# Altium schematic sheet microdevel_power.schdoc
size A4
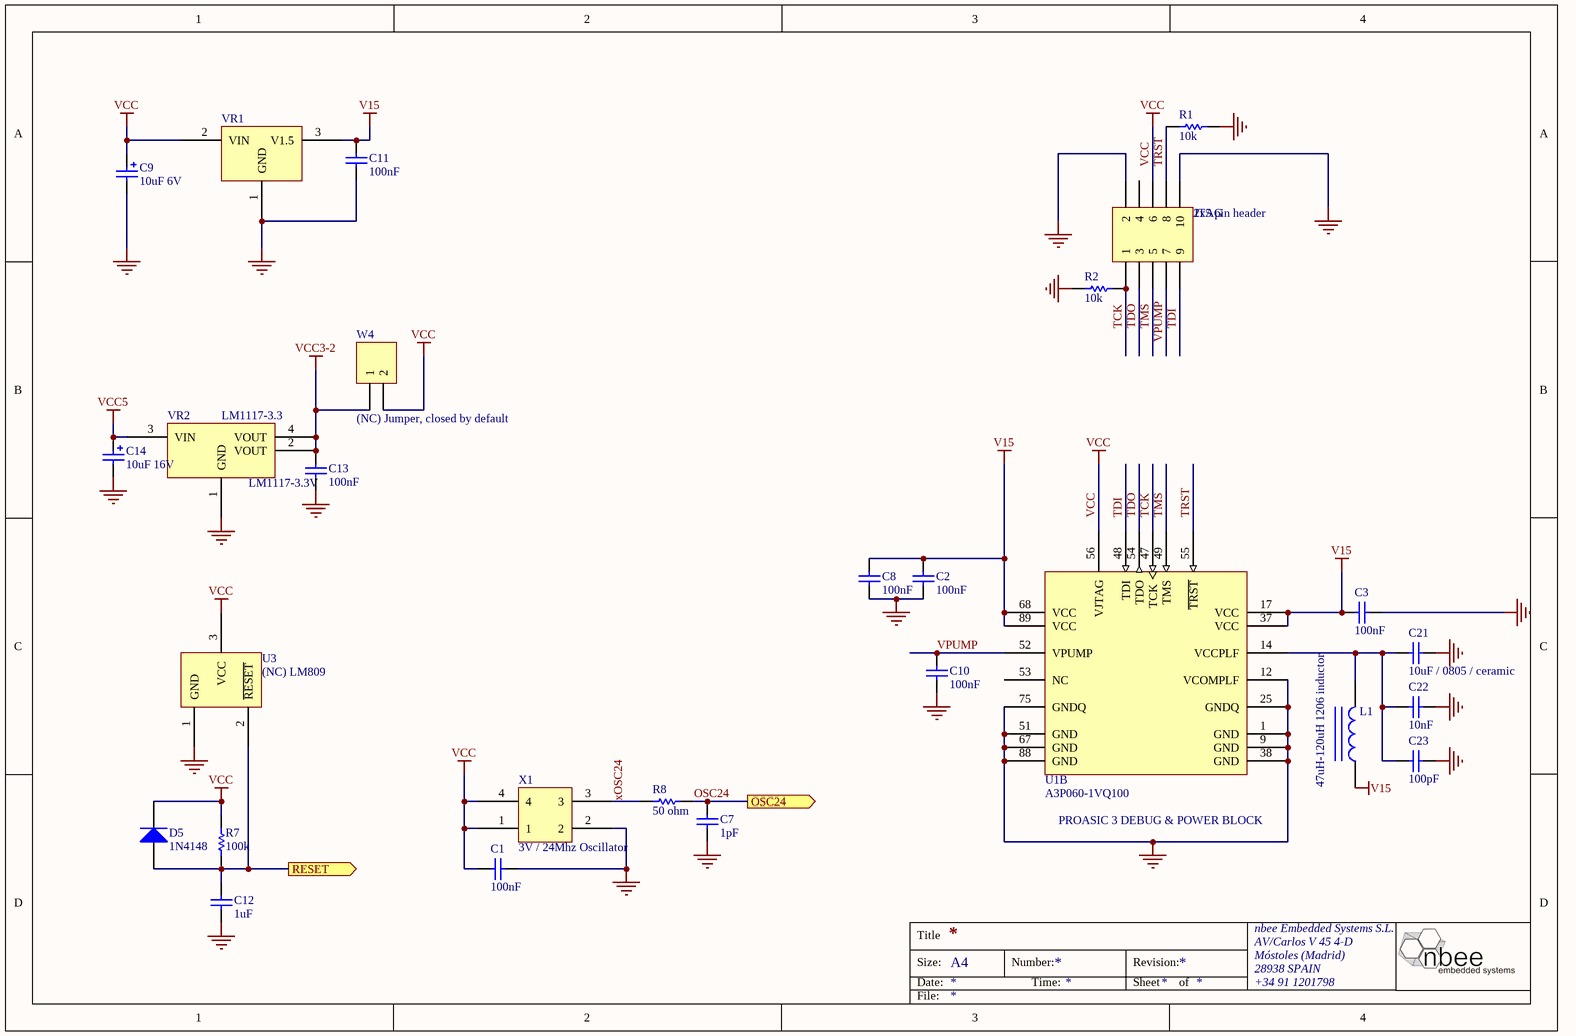
[diagram p0: microdevel_power.schdoc]

## Parts
C1  100nF  [0603]
C2  100nF  [0603]
C3  100nF  [0603]
C7  1pF  [0603]
C8  100nF  [0603]
C9  10uF 6V  [CC-6030]
C10  100nF  [0603]
C11  100nF  [0603]
C12  1uF  [0603]
C13  100nF  [0603]
C14  10uF 16V  [CC-6030]
C21  10uF / 0805 / ceramic  [0805]
C22  10nF  [0603]
C23  100pF  [0603]
D5  1N4148  [DIODE_1206]
JTAG  2x5 pin header  [HDR2X5]
L1  47uH-120uH 1206 inductor  [1206]
R1  10k  [0603]
R2  10k  [0603]
R7  100k  [0603]
R8  50 ohm  [0603]
U1  A3P060-1VQ100  [A3P060]  (part B of 2)
U3  (NC) LM809  [SOT23-2]
VR1  LDO 1.5V  [G4TOB]  (value not drawn)
VR2  LM1117-3.3V  value LM1117-3.3  [DSO-G3]
W4  (NC) Jumper, closed by default  [JUMPER]
X1  3V / 24Mhz Oscillator  [OSC 3x5mm]

## Ports
OSC24 (out), RESET (out)

## Nets
GND: C1.2 C2.1 C3.2 C7.1 C8.1 C9.2 C10.1 C11.1 C12.1 C13.1 C14.2 C21.2 C22.2 C23.2 JTAG.2 JTAG.10 R1.1 R2.1 U1.1(GND) U1.9(GND) U1.12(VCOMPLF) U1.25(GNDQ) U1.38(GND) U1.51(GND) U1.67(GND) U1.75(GNDQ) U1.88(GND) U3.1(GND) VR1.1(GND) VR2.1(GND) X1.2
V15: C2.2 C3.1 C8.2 C11.2 L1.1 U1.17(VCC) U1.37(VCC) U1.68(VCC) U1.89(VCC) VR1.3(V1.5)
VCC: C1.1 C9.1 D5.2(K) JTAG.6 R7.2 U1.56(VJTAG) U3.3(VCC) VR1.2(VIN) W4.2 X1.1 X1.4
VCC3-2: C13.2 VR2.2(VOUT) VR2.4(VOUT) W4.1
VCC5: C14.1 VR2.3(VIN)
OSC24: C7.2 R8.1 ; port OSC24
RESET: C12.2 D5.1(A) R7.1 U3.2(~{RESET}) ; port RESET
TCK: JTAG.1 R2.2 U1.47(TCK)
TDI: JTAG.9 U1.48(TDI)
TDO: JTAG.3 U1.54(TDO)
TMS: JTAG.5 U1.49(TMS)
TRST: JTAG.8 R1.2 U1.55(~{TRST})
VPUMP: C10.2 JTAG.7 U1.52(VPUMP)
xOSC24: R8.2 X1.3
NetC21_1: C21.1 C22.1 C23.1 L1.2 U1.14(VCCPLF)

Not connected (* = marked no-connect by the designer): JTAG 4; U1 53(NC)

## Notes on the sheet
- PROASIC 3 DEBUG & POWER BLOCK
- Title
- Size:
- Date:
- A4
- Number:
- Time:
- Revision:
- Sheet
- of
- nbee Embedded Systems S.L.
- AV/Carlos V 45 4-D
- Móstoles (Madrid)
- 28938 SPAIN
- +34 91 1201798
- File:

## Library data of the parts
C1-C3 C7 C8 C10-C13 C22 C23 = Cap Semi: Capacitor (Semiconductor SIM Model); Published: 8-Jun-2000; LatestRevisionDate: 17-Jul-2002; LatestRevisionNote: Re-released for DXP Platform.; PackageReference: C1206; Publisher: Altium Limited
C9 C14 = Cap Pol3: Polarized Capacitor (Surface Mount); Manufacturer: Generic Components; Class: Passive; Published: 08/06/2000; Publisher: Altium Hobart Technology Centre; SubClass: Capacitor
  C9: Value: 10uF 6V
  C14: Value: 10uF 16V
C21 = Cap Semi: 10uF ceramic capacitor; Published: 8-Jun-2000; LatestRevisionDate: 17-Jul-2002; LatestRevisionNote: Re-released for DXP Platform.; PackageReference: C1206; Publisher: Altium Limited
D5 = Diode: Default Diode; Published: 8-Jun-2000; LatestRevisionDate: 17-Jul-2002; LatestRevisionNote: Re-released for DXP Platform.; PackageDocument: Sep-1996; PackageReference: SMC; Publisher: Altium Limited; Code_JEDEC: DO-214-AB
JTAG = Header 5X2: Header, 5-Pin, Dual row; LatestRevisionDate: 17-Jul-2002; LatestRevisionNote: Re-released for DXP Platform.; Publisher: Altium Limited
L1 = Inductor Iron: Magnetic-Core Inductor; Published: 24-Mar-1999; LatestRevisionDate: 17-Jul-2002; LatestRevisionNote: Re-released for DXP Platform.; PackageReference: AXIAL-0.9; Publisher: Altium Limited; PackageDescription: Axial Device, Thru-Hole; 2 Leads; 0.9 in Pin Spacing; datasheet1: http://www.murata-ps.com/data/magnetics/kmp_2200rm.pdf
R1 R2 R7 R8 = Res1: Resistor; Published: 8-Jun-2000; LatestRevisionDate: 17-Jul-2002; LatestRevisionNote: Re-released for DXP Platform.; Publisher: Altium Limited
U1 = A3P060-1VQ100: ProASIC3 Flash Family FPGA, 71 User IOs, 60K System Gates, 18 Kbits RAM, 1 Kbit Flash ROM, 1 PLL, 100-Pin VQFP, Commercial Grade; PackageDocument: ver8.7, Jun-2004; Published: 4-Mar-2005; DatasheetDocument: Jan-2005; PackageReference: VQ100; Publisher: Altium Limited; ComponentLink1Description: Flash Devices Home Page; ComponentLink1URL: http://www.actel.com/products/pa3/index.aspx; ComponentLink2Description: Datasheet; ComponentLink2URL: http://www.actel.com/documents/PA3_DS.pdf; ComponentLink3Description: Packaging Specification; ComponentLink3URL: http://www.actel.com/documents/PckgMechDrwngs.pdf; Code_JEDEC: MS-036-AED; Code_IPC: SQFP14X14-100
U3 = LM809
VR1 = VREG1_5
VR2 = LM1117-3.3
W4 = Header 2H: Header, 2-Pin, Right Angle; LatestRevisionDate: 17-Jul-2002; LatestRevisionNote: Re-released for DXP Platform.; Publisher: Altium Limited
X1 = OSCILATOR